# Altium project JlinkV9mini.PrjPcb
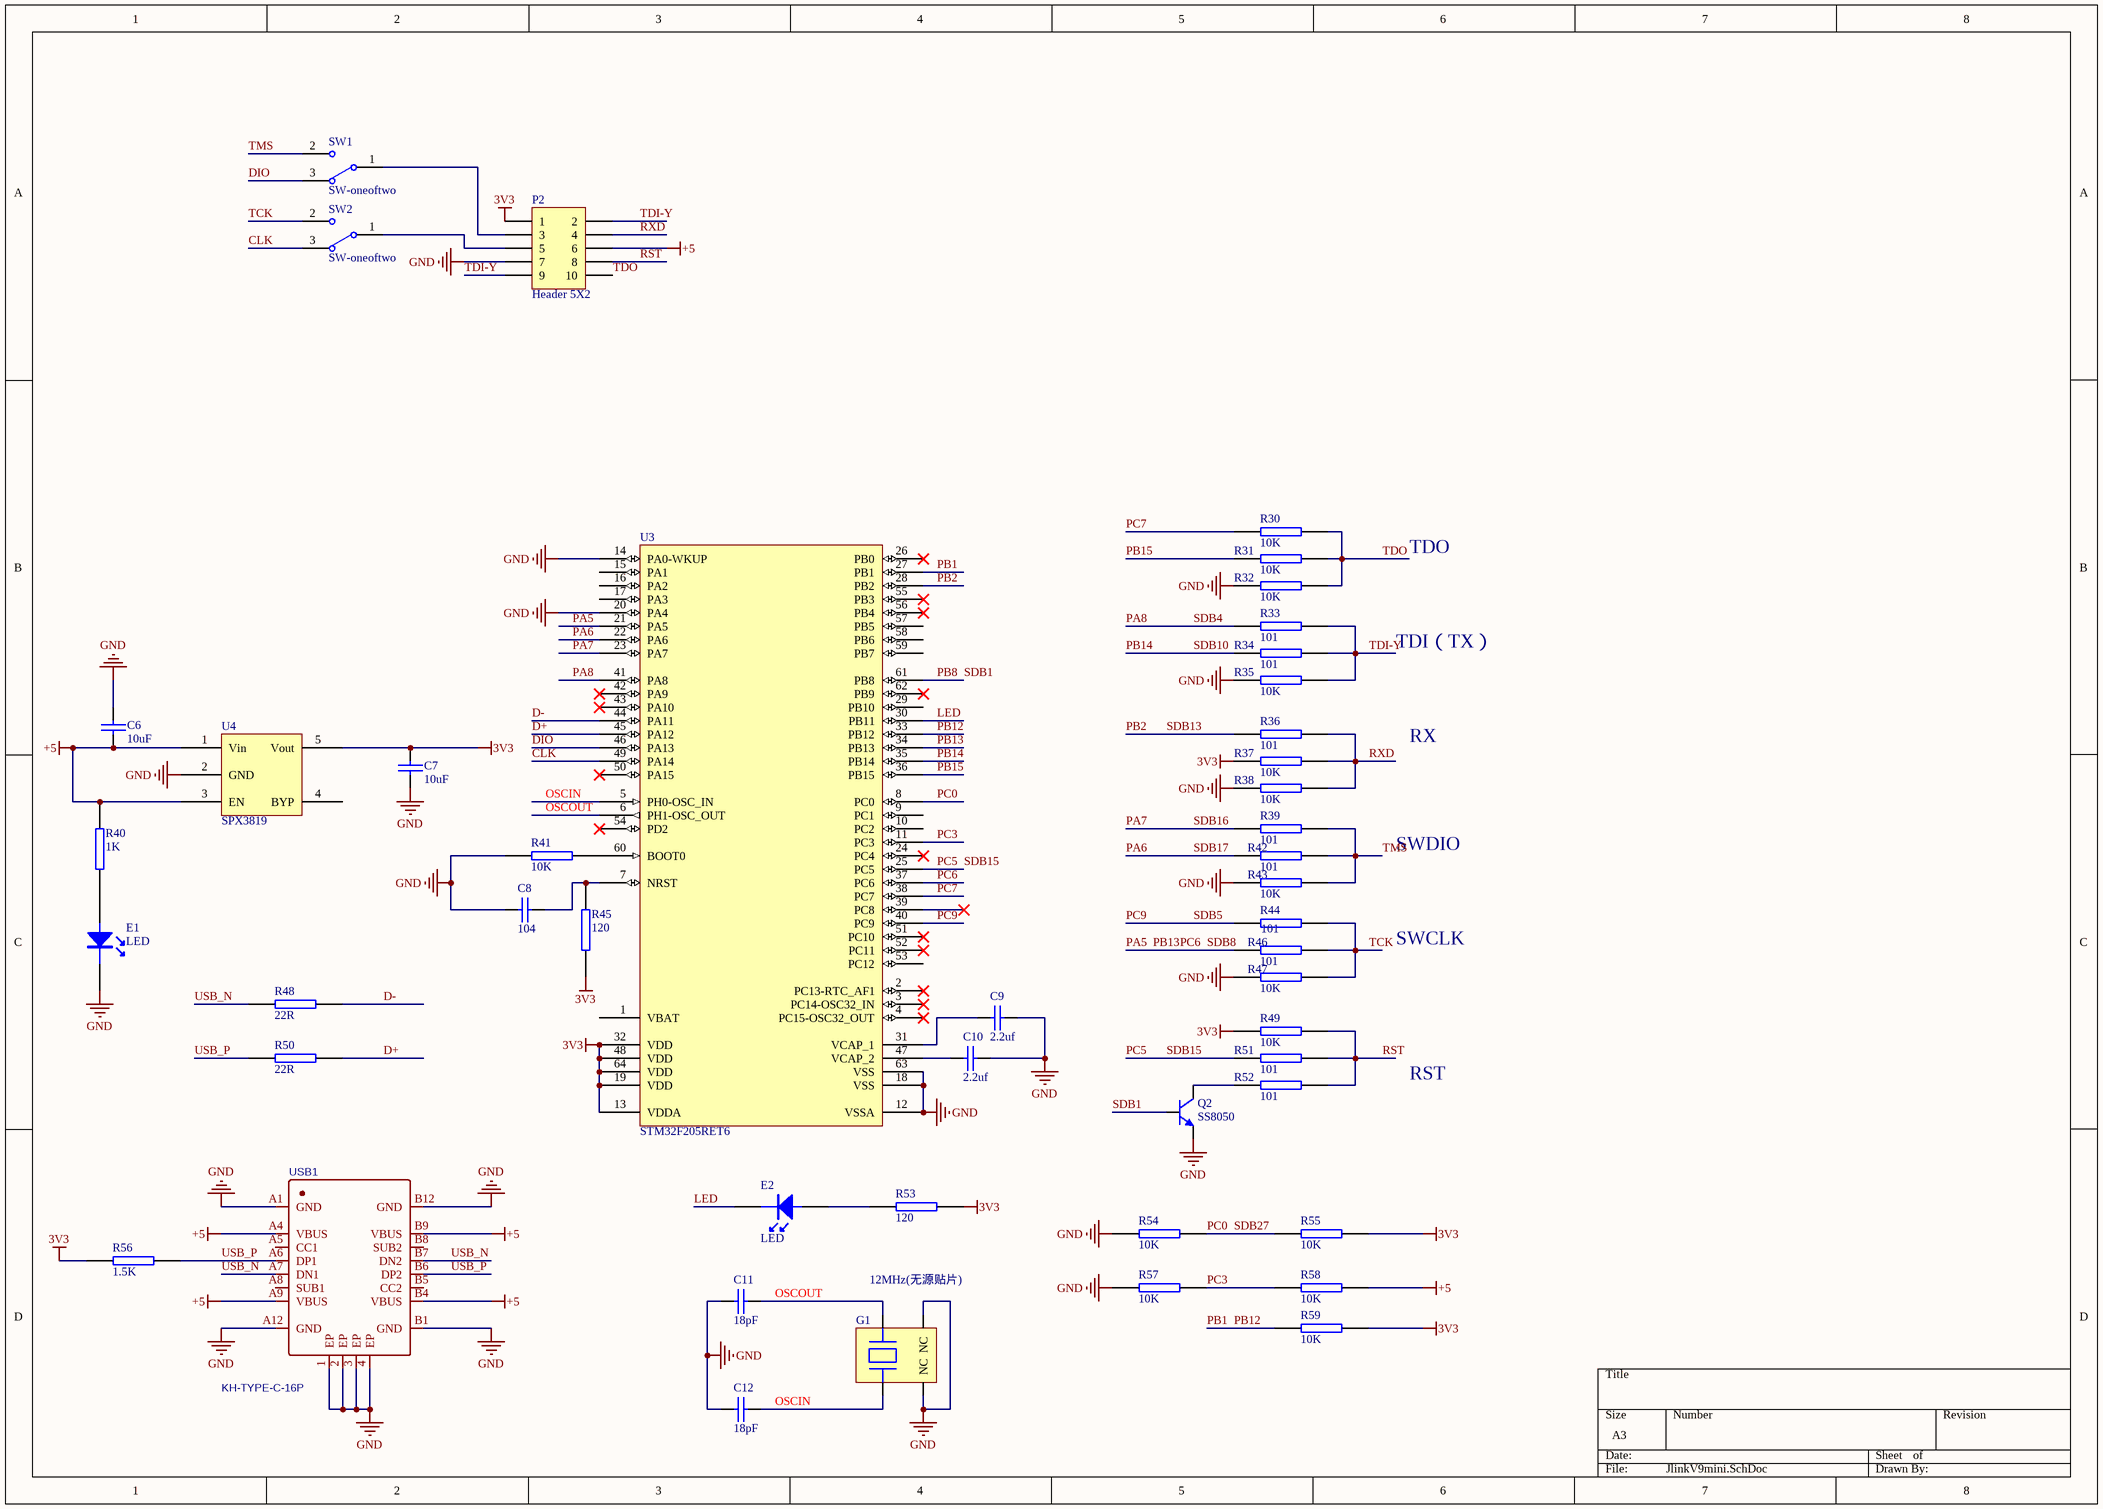
[diagram p0: JlinkV9mini.SchDoc]
1 sheet, 47 parts. Net scope: global (net labels, ports and power ports of the same name join across sheets).
Board file: JlinkV9mini.PcbDoc

## Sheet JlinkV9mini.SchDoc
size A3

### Parts
C6  10uF  [0603]
C7  10uF  [0603]
C8  104  [0603]
C9  2.2uf  [0603]
C10  2.2uf  [0603]
C11  18pF  [0603]
C12  18pF  [0603]
E1  LED  [LED_0603L]
E2  LED  [LED_0603L]
G1  12MHz(无源贴片)  [G3225]
P2  Header 5X2  [300S-2*5P 2.54MM_2]
Q2  SS8050  [SOT23-3N]
R30  10K  [0603]
R31  10K  [0603]
R32  10K  [0603]
R33  101  [0603]
R34  101  [0603]
R35  10K  [0603]
R36  101  [0603]
R37  10K  [0603]
R38  10K  [0603]
R39  101  [0603]
R40  1K  [0603]
R41  10K  [0603]
R42  101  [0603]
R43  10K  [0603]
R44  101  [0603]
R45  120  [0603]
R46  101  [0603]
R47  10K  [0603]
R48  22R  [0603]
R49  10K  [0603]
R50  22R  [0603]
R51  101  [0603]
R52  101  [0603]
R53  120  [0603]
R54  10K  [0603]
R55  10K  [0603]
R56  1.5K  [0603]
R57  10K  [0603]
R58  10K  [0603]
R59  10K  [0603]
SW1  SW-oneoftwo  [SW-oneoftwo-0603]
SW2  SW-oneoftwo  [SW-oneoftwo-0603]
U3  STM32F205RET6  [LQFP64 10x10_N]
U4  SPX3819  [SOT-23-5]
USB1  KH-TYPE-C-16P  [USB-C-16P]

### Nets
3V3: C7.1 P2.1 R37.1 R45.1 R49.1 R53.2 R55.2 R56.2 R59.2 U3.13(VDDA) U3.19(VDD) U3.32(VDD) U3.48(VDD) U3.64(VDD) U4.5(Vout)
+5: C6.2 P2.6 R40.1 R58.2 U4.1(Vin) U4.3(EN) USB1.A4(VBUS) USB1.A9(VBUS) USB1.B4(VBUS) USB1.B9(VBUS)
GND: C6.1 C7.2 C8.1 C9.2 C10.2 C11.1 C12.1 E1.2 G1.2(NC) G1.4(NC) P2.7 Q2.2(E) R32.1 R35.1 R38.1 R41.1 R43.1 R47.1 R54.1 R57.1 U3.12(VSSA) U3.14(PA0-WKUP) U3.18(VSS) U3.20(PA4) U3.63(VSS) U4.2(GND) USB1.1(EP) USB1.2(EP) USB1.3(EP) USB1.4(EP) USB1.A1(GND) USB1.A12(GND) USB1.B1(GND) USB1.B12(GND)
CLK: SW2.3 U3.49(PA14)
D+: R50.1 U3.45(PA12)
D-: R48.1 U3.44(PA11)
DIO: SW1.3 U3.46(PA13)
LED: E2.2 U3.30(PB11)
OSCIN: C12.2 G1.1 U3.5(PH0-OSC_IN)
OSCOUT: C11.2 G1.3 U3.6(PH1-OSC_OUT)
PA5: R46.1 U3.21(PA5) U3.34(PB13) U3.37(PC6)  [also labelled PB13, PC6, SDB8]
PA6: R42.1 U3.22(PA6)  [also labelled SDB17]
PA7: R39.1 U3.23(PA7)  [also labelled SDB16]
PA8: R33.1 U3.41(PA8)  [also labelled SDB4]
PB1: R59.1 U3.27(PB1) U3.33(PB12)  [also labelled PB12]
PB2: R36.1 U3.28(PB2)  [also labelled SDB13]
PB8: Q2.1(B) U3.61(PB8)  [also labelled SDB1]
PB14: R34.1 U3.35(PB14)  [also labelled SDB10]
PB15: R31.1 U3.36(PB15)
PC0: R54.2 R55.1 U3.8(PC0)  [also labelled SDB27]
PC3: R57.2 R58.1 U3.11(PC3)
PC5: R51.1 U3.25(PC5)  [also labelled SDB15]
PC7: R30.1 U3.38(PC7)
PC9: R44.1 U3.40(PC9)  [also labelled SDB5]
RST: P2.8 R49.2 R51.2 R52.2
RXD: P2.4 R36.2 R37.2 R38.2
TCK: R44.2 R46.2 R47.2 SW2.2
TDI-Y: P2.2 P2.9 R33.2 R34.2 R35.2
TDO: P2.10 R30.2 R31.2 R32.2
TMS: R39.2 R42.2 R43.2 SW1.2
USB_N: R48.2 USB1.A7(DN1) USB1.B7(DN2)
USB_P: R50.2 R56.1 USB1.A6(DP1) USB1.B6(DP2)
NetC8_2: C8.2 R45.2 U3.7(NRST)
NetC9_1: C9.1 U3.31(VCAP_1)
NetC10_1: C10.1 U3.47(VCAP_2)
NetE1_1: E1.1 R40.2
NetE2_1: E2.1 R53.1
NetP2_3: P2.3 SW1.1
NetP2_5: P2.5 SW2.1
NetQ2_3: Q2.3(C) R52.1
NetR41_2: R41.2 U3.60(BOOT0)

Not connected (* = marked no-connect by the designer): U3 1(VBAT) 2(PC13-RTC_AF1)* 3(PC14-OSC32_IN)* 4(PC15-OSC32_OUT)* 9(PC1) 10(PC2) 15(PA1) 16(PA2) 17(PA3) 24(PC4)* 26(PB0)* 29(PB10) 39(PC8)* 42(PA9)* 43(PA10)* 50(PA15)* 51(PC10)* 52(PC11)* 53(PC12) 54(PD2)* 55(PB3)* 56(PB4)* 57(PB5) 58(PB6) 59(PB7) 62(PB9)*; U4 4(BYP); USB1 A5(CC1) A8(SUB1) B5(CC2) B8(SUB2)

### Notes on the sheet
- TDO
- TDI（TX）
- RX
- SWDIO
- SWCLK
- RST

### Library data of the parts
C6-C10 = CAP Nonpolarity: 无极电容
C11 C12 = CAP: 无极电容
E1 E2 = LED: LED灯
G1 = MM-11B: 无源晶振MCU使用
P2 = Header 5X2: Header, 5-Pin, Dual row; LatestRevisionDate: 17-Jul-2002; LatestRevisionNote: Re-released for DXP Platform.; Publisher: Altium Limited
Q2 = 8050-SMD: 高频放大-NPN型; 版权归属: 源创客; 属性: 40V 1.5A 1W 100MHZ; BOM名称: 高频放大-NPN型; 学习资源: www.ooocke.com
R30-R59 = R: 电阻
SW1 SW2 = SW-oneoftwo: 二选一电阻开关
U3 = STM32F205RET6: Microcontroller   ST; Code: 104261; Vision: V5.0; Value: STM32F205RET6; LatestRevisionDate: 25-Mar-2015; PackageReference: SQFP10x10-64; Brand: ST; InitialReleaseDate: 25-Mar-2015
U4 = SPX3819: 稳压器
USB1 = USB-TYPE-C 16P: BOM_Manufacturer: Shenzhen Kinghelm Elec; Contributor: LCSC; BOM_Supplier: LCSC; BOM_Supplier Part: C709357; BOM_Manufacturer Part: KH-TYPE-C-16P; spicePre: U; spiceSymbolName: KH-TYPE-C-16P